# Altium schematic sheet Analog_Testbed.SchDoc
size A4; SheetNumber: 2; SheetTotal: 4
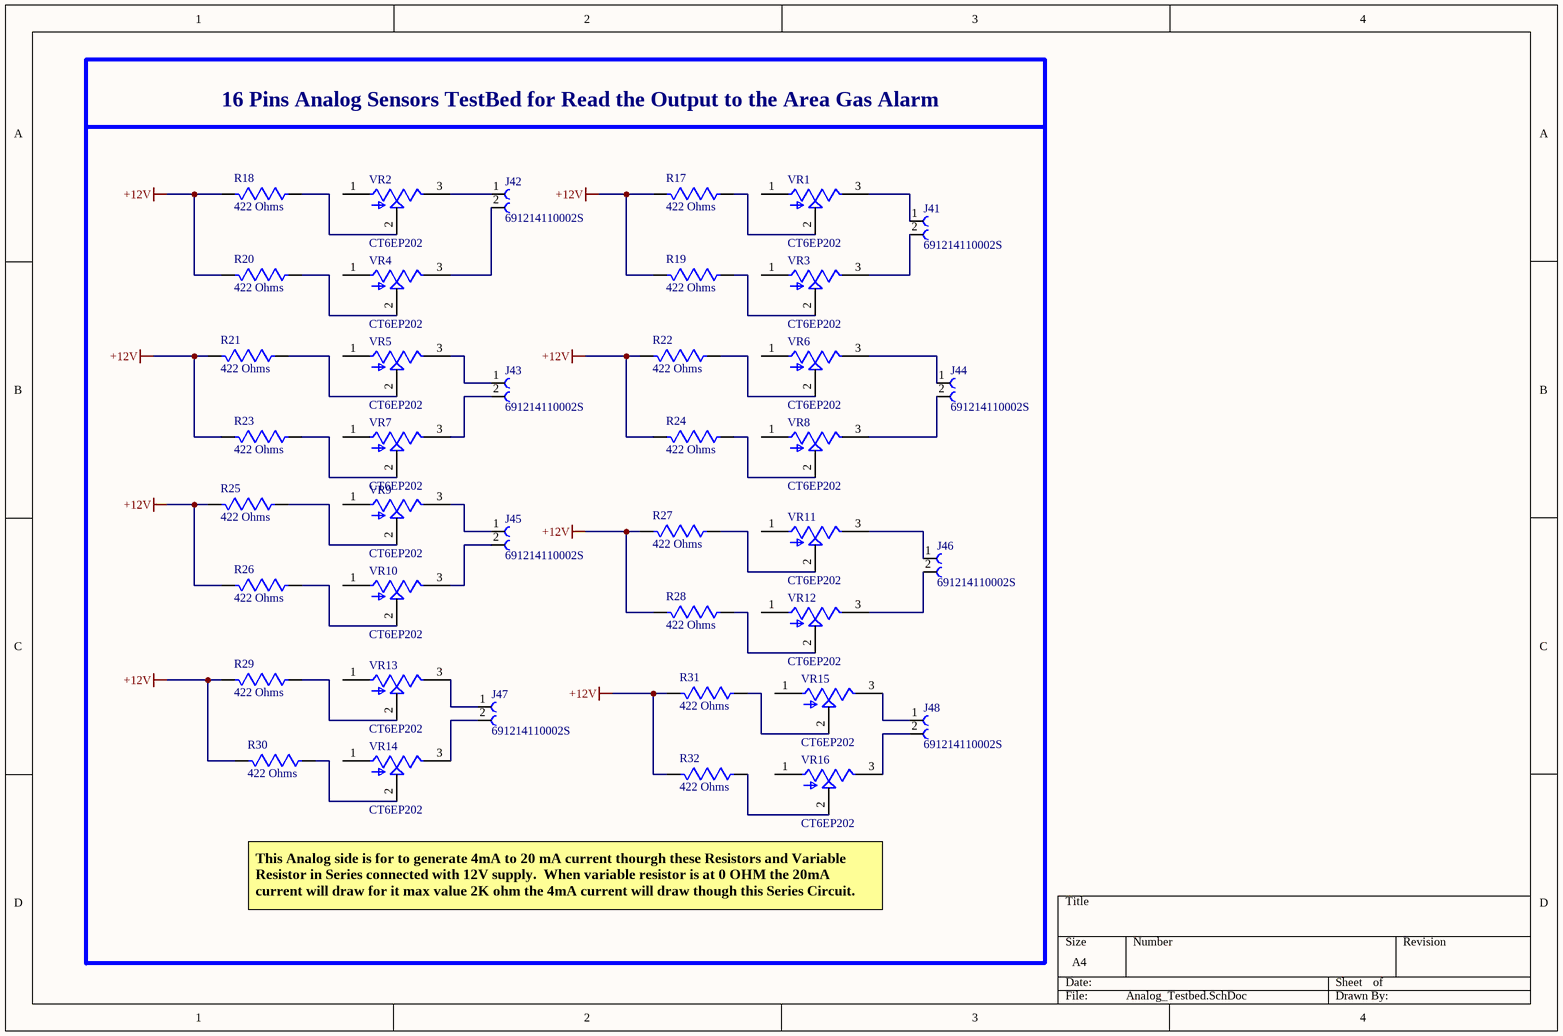
[diagram p0: Analog_Testbed.SchDoc]

## Parts
J41  691214110002S  [691214110002S]
J42  691214110002S  [691214110002S]
J43  691214110002S  [691214110002S]
J44  691214110002S  [691214110002S]
J45  691214110002S  [691214110002S]
J46  691214110002S  [691214110002S]
J47  691214110002S  [691214110002S]
J48  691214110002S  [691214110002S]
R17  422 Ohms  [RES_422]
R18  422 Ohms  [RES_422]
R19  422 Ohms  [RES_422]
R20  422 Ohms  [RES_422]
R21  422 Ohms  [RES_422]
R22  422 Ohms  [RES_422]
R23  422 Ohms  [RES_422]
R24  422 Ohms  [RES_422]
R25  422 Ohms  [RES_422]
R26  422 Ohms  [RES_422]
R27  422 Ohms  [RES_422]
R28  422 Ohms  [RES_422]
R29  422 Ohms  [RES_422]
R30  422 Ohms  [RES_422]
R31  422 Ohms  [RES_422]
R32  422 Ohms  [RES_422]
VR1  CT6EP202  [CT6EP202]
VR2  CT6EP202  [CT6EP202]
VR3  CT6EP202  [CT6EP202]
VR4  CT6EP202  [CT6EP202]
VR5  CT6EP202  [CT6EP202]
VR6  CT6EP202  [CT6EP202]
VR7  CT6EP202  [CT6EP202]
VR8  CT6EP202  [CT6EP202]
VR9  CT6EP202  [CT6EP202]
VR10  CT6EP202  [CT6EP202]
VR11  CT6EP202  [CT6EP202]
VR12  CT6EP202  [CT6EP202]
VR13  CT6EP202  [CT6EP202]
VR14  CT6EP202  [CT6EP202]
VR15  CT6EP202  [CT6EP202]
VR16  CT6EP202  [CT6EP202]

## Nets
+12V: R17.1(CCW) R18.1(CCW) R19.1(CCW) R20.1(CCW) R21.1(CCW) R22.1(CCW) R23.1(CCW) R24.1(CCW) R25.1(CCW) R26.1(CCW) R27.1(CCW) R28.1(CCW) R29.1(CCW) R30.1(CCW) R31.1(CCW) R32.1(CCW)
NetJ41_1: J41.1 VR1.3(CW)
NetJ41_2: J41.2 VR3.3(CW)
NetJ42_1: J42.1 VR2.3(CW)
NetJ42_2: J42.2 VR4.3(CW)
NetJ43_1: J43.1 VR5.3(CW)
NetJ43_2: J43.2 VR7.3(CW)
NetJ44_1: J44.1 VR6.3(CW)
NetJ44_2: J44.2 VR8.3(CW)
NetJ45_1: J45.1 VR9.3(CW)
NetJ45_2: J45.2 VR10.3(CW)
NetJ46_1: J46.1 VR11.3(CW)
NetJ46_2: J46.2 VR12.3(CW)
NetJ47_1: J47.1 VR13.3(CW)
NetJ47_2: J47.2 VR14.3(CW)
NetJ48_1: J48.1 VR15.3(CW)
NetJ48_2: J48.2 VR16.3(CW)
NetR17_2: R17.2(CW) VR1.2(WIPER)
NetR18_2: R18.2(CW) VR2.2(WIPER)
NetR19_2: R19.2(CW) VR3.2(WIPER)
NetR20_2: R20.2(CW) VR4.2(WIPER)
NetR21_2: R21.2(CW) VR5.2(WIPER)
NetR22_2: R22.2(CW) VR6.2(WIPER)
NetR23_2: R23.2(CW) VR7.2(WIPER)
NetR24_2: R24.2(CW) VR8.2(WIPER)
NetR25_2: R25.2(CW) VR9.2(WIPER)
NetR26_2: R26.2(CW) VR10.2(WIPER)
NetR27_2: R27.2(CW) VR11.2(WIPER)
NetR28_2: R28.2(CW) VR12.2(WIPER)
NetR29_2: R29.2(CW) VR13.2(WIPER)
NetR30_2: R30.2(CW) VR14.2(WIPER)
NetR31_2: R31.2(CW) VR15.2(WIPER)
NetR32_2: R32.2(CW) VR16.2(WIPER)

Not connected (* = marked no-connect by the designer): VR1 1(CCW); VR2 1(CCW); VR3 1(CCW); VR4 1(CCW); VR5 1(CCW); VR6 1(CCW); VR7 1(CCW); VR8 1(CCW); VR9 1(CCW); VR10 1(CCW); VR11 1(CCW); VR12 1(CCW); VR13 1(CCW); VR14 1(CCW); VR15 1(CCW); VR16 1(CCW)

## Notes on the sheet
- 16 Pins Analog Sensors TestBed for Read the Output to the Area Gas Alarm
- This Analog side is for to generate 4mA to 20 mA current thourgh these Resistors and Variable Resistor in Series connected with 12V supply.  When variable resistor is at 0 OHM the 20mA current will draw for it max value 2K ohm the 4mA current will draw though this Series Circuit.

## Library data of the parts
J41-J48 = 691214110002S: 2 Position Wire to Board Terminal Block Horizontal with Board 0.138 (3.50mm) Through Hole; MF: WÃ¼rth Elektronik; Check_prices: https://www.snapeda.com/parts/691214110002S/Wurth+Elektronik/view-part/?ref=eda; Availability: In Stock; Price: None; Package: None; Value: *; SnapEDA_Link: https://www.snapeda.com/parts/691214110002S/Wurth+Elektronik/view-part/?ref=snap; MP: 691214110002S; Purchase-URL: https://pricing.snapeda.com/search/part/691214110002S/?ref=eda
R17-R32 = RES_422: 1W Thick Film Resistors 200V ±100ppm/℃ ±1% -55℃~+155℃ 422Ω 2512 Chip Resistor - Surface Mount ROHS